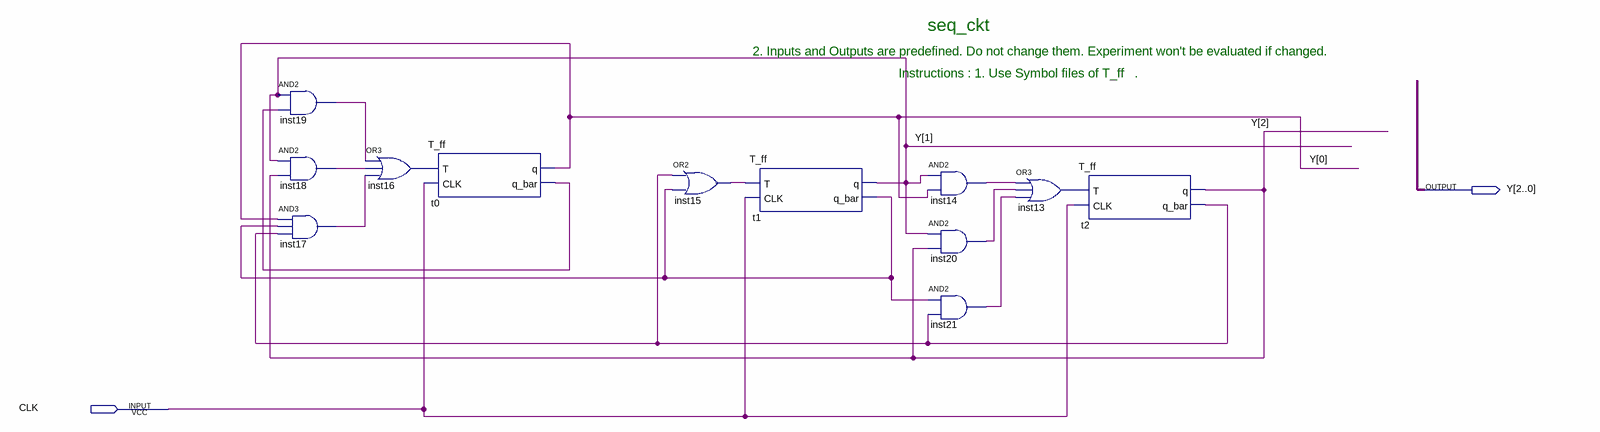
[diagram p0: schematic sheet]
// Quartus schematic seq_block.bdf as structural Verilog: 12 symbols, 2 pins
module seq_block (
  input  CLK,
  output [2:0] Y
);

  wire inst13_out, inst14_out, inst15_out, inst16_out, inst17_out, inst18_out, inst19_out, inst20_out,
       inst21_out, t0_q_bar, t1_q_bar, t2_q_bar;

  and inst19 (inst19_out, Y[1], t0_q_bar);
  and inst18 (inst18_out, Y[1], Y[2]);
  and inst17 (inst17_out, Y[0], t1_q_bar, t2_q_bar);
  or inst16 (inst16_out, inst19_out, inst18_out, inst17_out);
  T_ff t0 (.T(inst16_out), .CLK(CLK), .q(Y[0]), .q_bar(t0_q_bar));
  or inst15 (inst15_out, t2_q_bar, t1_q_bar);
  T_ff t1 (.T(inst15_out), .CLK(CLK), .q(Y[1]), .q_bar(t1_q_bar));
  and inst14 (inst14_out, Y[1], Y[0]);
  and inst20 (inst20_out, Y[1], Y[2]);
  and inst21 (inst21_out, t1_q_bar, t2_q_bar);
  or inst13 (inst13_out, inst14_out, inst20_out, inst21_out);
  T_ff t2 (.T(inst13_out), .CLK(CLK), .q(Y[2]), .q_bar(t2_q_bar));

  // Notes on the sheet:
  //   seq_ckt
  //   2. Inputs and Outputs are predefined. Do not change them. Experiment won't be evaluated if changed.
  //   Instructions : 1. Use Symbol files of T_ff   . 
endmodule
